# EAGLE design iPad Charge Single (EAGLE 5.11)
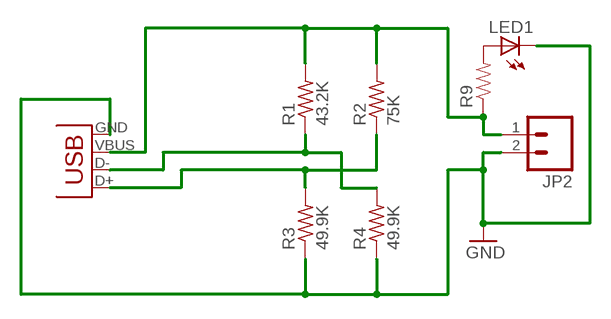
[diagram p0: schematic, sheet 1]

## Parts
JP2  M023.5MM  [SCREWTERMINAL-3.5MM-2]
LED1  LED0603  [LED-0603]
R1  43.2K  R-US_0309/V  [0309V]
R2  75K  R-US_0309/V  [0309V]
R3  49.9K  R-US_0309/V  [0309V]
R4  49.9K  R-US_0309/V  [0309V]
R9  RESISTOR0603-RES  [0603-RES]
X1  USB-A-S  [USB-A-S]

## Nets
GND: JP2.2 LED1.C R3.1 R4.1 X1.GND
N$1: JP2.1 R1.2 R2.2 R9.1 X1.VBUS
N$3: R2.1 R3.2 X1.D+
N$4: R1.1 R4.2 X1.D-
N$9: LED1.A R9.2

## Library data of the parts
JP2 = SparkFun:M02: Header 2 Standard 2-pin 0.1" header. Use with straight break away headers (SKU : PRT-00116), right angle break away headers (PRT-00553), swiss pins (PRT-00743), machine pins (PRT-00117), and female headers (PRT-00115). Molex polarized connector foot print use with SKU : PRT-08233 with associated crimp pins and housings.
LED1 = SparkFun:LED: LEDs Standard schematic elements and footprints for 5mm, 3mm, 1206, and 0603 sized LEDs. 5mm - Spark Fun Electronics SKU : COM-00529 (and others)
R1-R4 = resistor:R-US_: RESISTOR, American symbol
R9 = SparkFun:RESISTOR: Resistor Basic schematic elements and footprints for 0603, 1206, and PTH resistors.
X1 = SparkFun:USB: USB Connectors USB-B-PTH is fully proven SKU : PRT-00139 USB-miniB is fully proven SKU : PRT-00587 USB-A-PCB is untested. USB-A-H is throughly reviewed, but untested. Spark Fun Electronics SKU : PRT-00437 USB-B-SMT is throughly reviewed, but untested. Needs silkscreen touching up. USB-A-S has not been used/tested USB-MB-H has not been used/tested

## Board
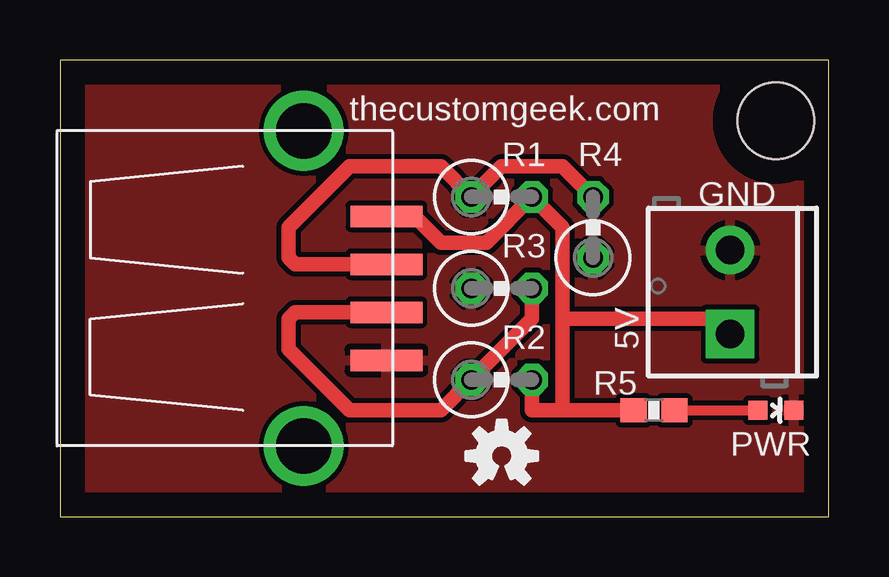
[diagram p1: board, top side]
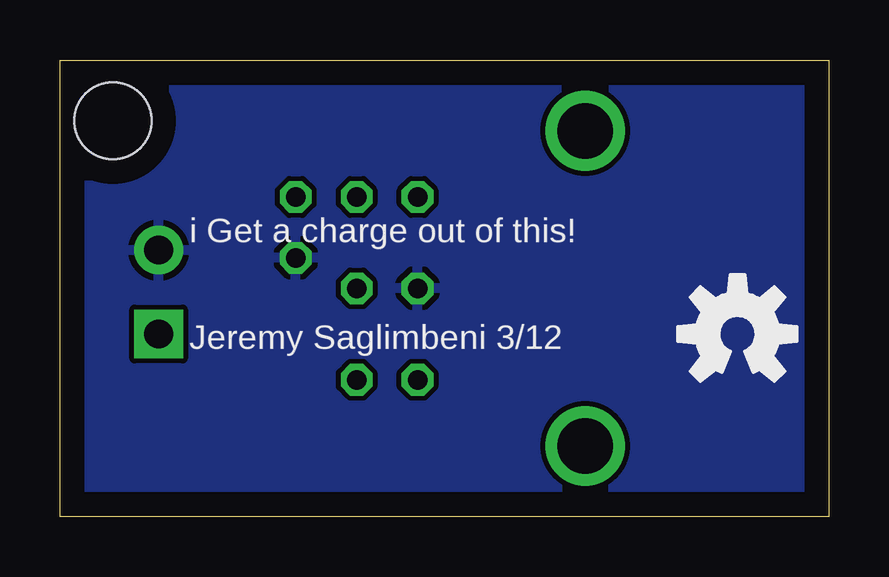
[diagram p2: board, bottom side, seen from below]

Size 32.05 x 19.04 mm. Coordinates in mm from the lower left corner, seen from the top.
Outline: 0,0 32.05,0 32.05,19.04 0,19.04 0,0
Copper layers (1*16): Top 0.035mm / dielectric 1.5mm / Bottom 0.035mm
Design rules "default": minimum track width 10mil, minimum drill 0.6mm, track to track 8mil, track to pad 8mil, pad to pad 8mil, via to via 8mil, smd to smd 8mil, copper to edge 40mil, drill to drill 8mil, minimum pad ring 10mil, minimum via ring 8mil, stop-mask expansion 4mil, vias tented up to drill 0mil, thermal gap 10mil
Holes 3.2 mm at 29.84,16.51

### Footprints (pad centres in the part's own frame; a part is rotated, then mirrored left to right if it is on the bottom)
SCREWTERMINAL-3.5MM-2 = drill 1.2 pad 2.032 square: 1 0,0 | drill 1.2 pad 2.032 round: 2 3.5,0
LED-0603 = smd 0.8 x 0.8: A 0,-0.75; C 0,0.75
0309V = drill 0.813 octagon: 1 -1.27,0; 2 1.27,0
0603-RES = smd 1.1 x 1: 1 -0.85,0; 2 0.85,0
USB-A-S = smd 3 x 0.9: D+ 3.45,-1; D- 3.45,1; GND 3.45,-3; VBUS 3.45,3 | drill 2.311 round: P$5 0,-6.566; P$6 0,6.566

### Placement (x,y rotation side)
JP2  27.94,7.62 90 top
LED1  29.84,4.45 270 top
R1  18.41,13.34 0 top
R2  18.41,5.71 0 top
R3  18.41,9.53 0 top
R4  22.23,12.06 90 top
R9  24.77,4.45 0 top
U$1  [OSHW-LOGO-S]  18.41,2.54 0 top
U$4  [OSHW-LOGO-M]  3.81,7.62 0 bottom
X1  10.16,9.53 0 top

### Tracks (layer width: path | path; a pad name or v marks a point on that pad's centre or on a via)
GND
  pour Top: 0,19.05 32.38,19.05 32.38,0 0,0
  pour Bottom: 0,19.05 32.38,19.05 32.38,0 0,0
N$1
  Top 0.61: 20.95,4.45 19.68,4.45 R2.2 | 20.95,4.45 R9.1 | 20.95,4.45 20.95,8.26 | 20.95,8.26 20.95,12.06 R1.2 17.78,11.43 15.88,11.43 14.78,12.53 X1.VBUS | 20.95,8.26 27.3,8.26 JP2.1
N$3
  Top 0.61: R3.2 19.68,8.26 R2.1 15.88,4.45 12.06,4.45 9.53,6.99 9.53,8.26 9.79,8.53 X1.D+
N$4
  Top 0.61: R4.2 20.95,14.61 18.41,14.61 R1.1 15.88,14.61 12.06,14.61 9.53,12.06 9.53,10.79 9.79,10.53 X1.D-
N$9
  Top 0.406: R9.2 LED1.A

### Text on the board
tPlace: thecustomgeek.com | R1 | R4 | GND | R3 | R2 | 5V | R5 | PWR
bPlace: i Get a charge out of this! | Jeremy Saglimbeni 3/12